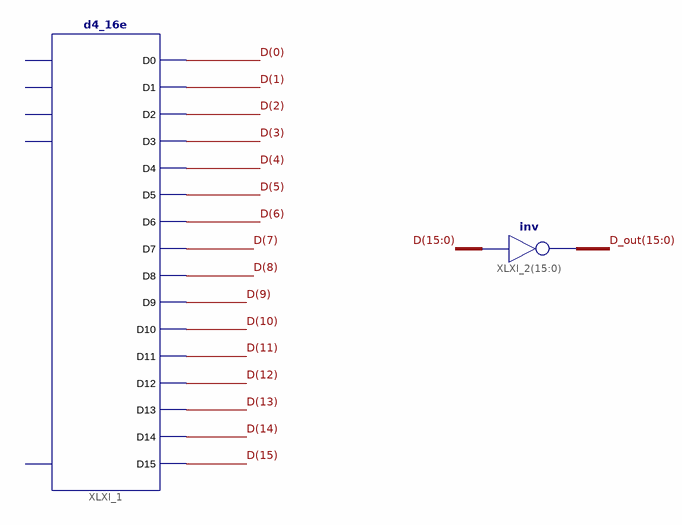
[diagram p0: schematic sheet 1]
// Xilinx ISE schematic BCD_4bit_Hex.sch (spartan6) as structural Verilog: 2 symbols, 0 ports
module BCD_4bit_Hex (
);

  wire [15:0] D, D_out;

  d4_16e XLXI_1 (
    .D0(D[0]), .D1(D[1]), .D10(D[10]), .D11(D[11]), .D12(D[12]), .D13(D[13]), .D14(D[14]), .D15(D[15]),
    .D2(D[2]), .D3(D[3]), .D4(D[4]), .D5(D[5]), .D6(D[6]), .D7(D[7]), .D8(D[8]), .D9(D[9]));  // open: A0, A1, A2, A3, E
  assign D_out = ~D;  // inv XLXI_2[15..0], 16 bits wide
endmodule
